# Altium schematic sheet 5V-3V3_Divider.SchDoc
size A4; SheetNumber: 7; SheetTotal: 16
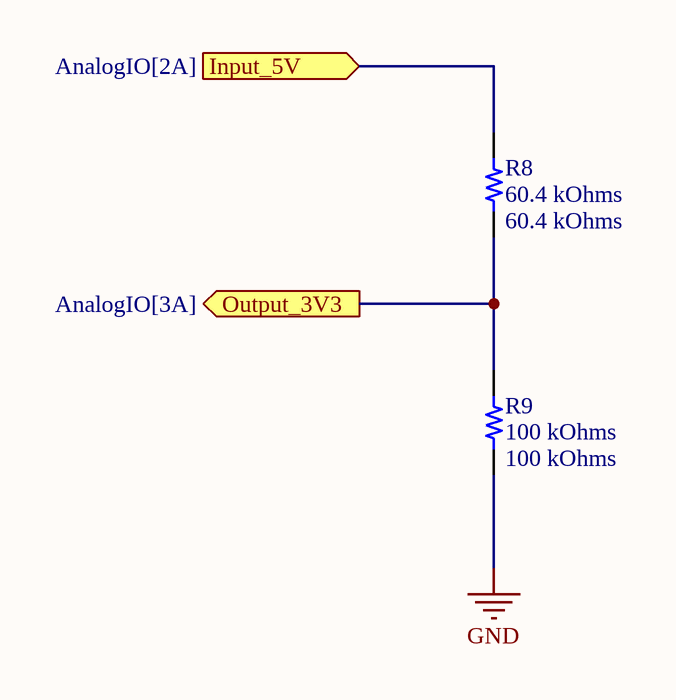
[diagram p0: 5V-3V3_Divider.SchDoc]

## Parts
R8  60.4 kOhms  [RES 0603_1608]
R9  100 kOhms  [RES 0603_1608]

## Ports
Input_5V (in, see AnalogIO[2A]), Output_3V3 (out, see AnalogIO[3A])

## Nets
GND: R9.1
Input_5V: R8.2 ; port Input_5V
Output_3V3: R8.1 R9.2 ; port Output_3V3

## Library data of the parts
R8 = AC0603FR-0760K4L: RES SMD 60.4K OHM 1% 1/10W 0603; Part Number: AC0603FR-0760K4L; Value: 60.4 kOhms
R9 = AA0603FR-07100KL: RES SMD 100K OHM 1% 1/10W 0603; Part Number: AA0603FR-07100KL; Value: 100 kOhms